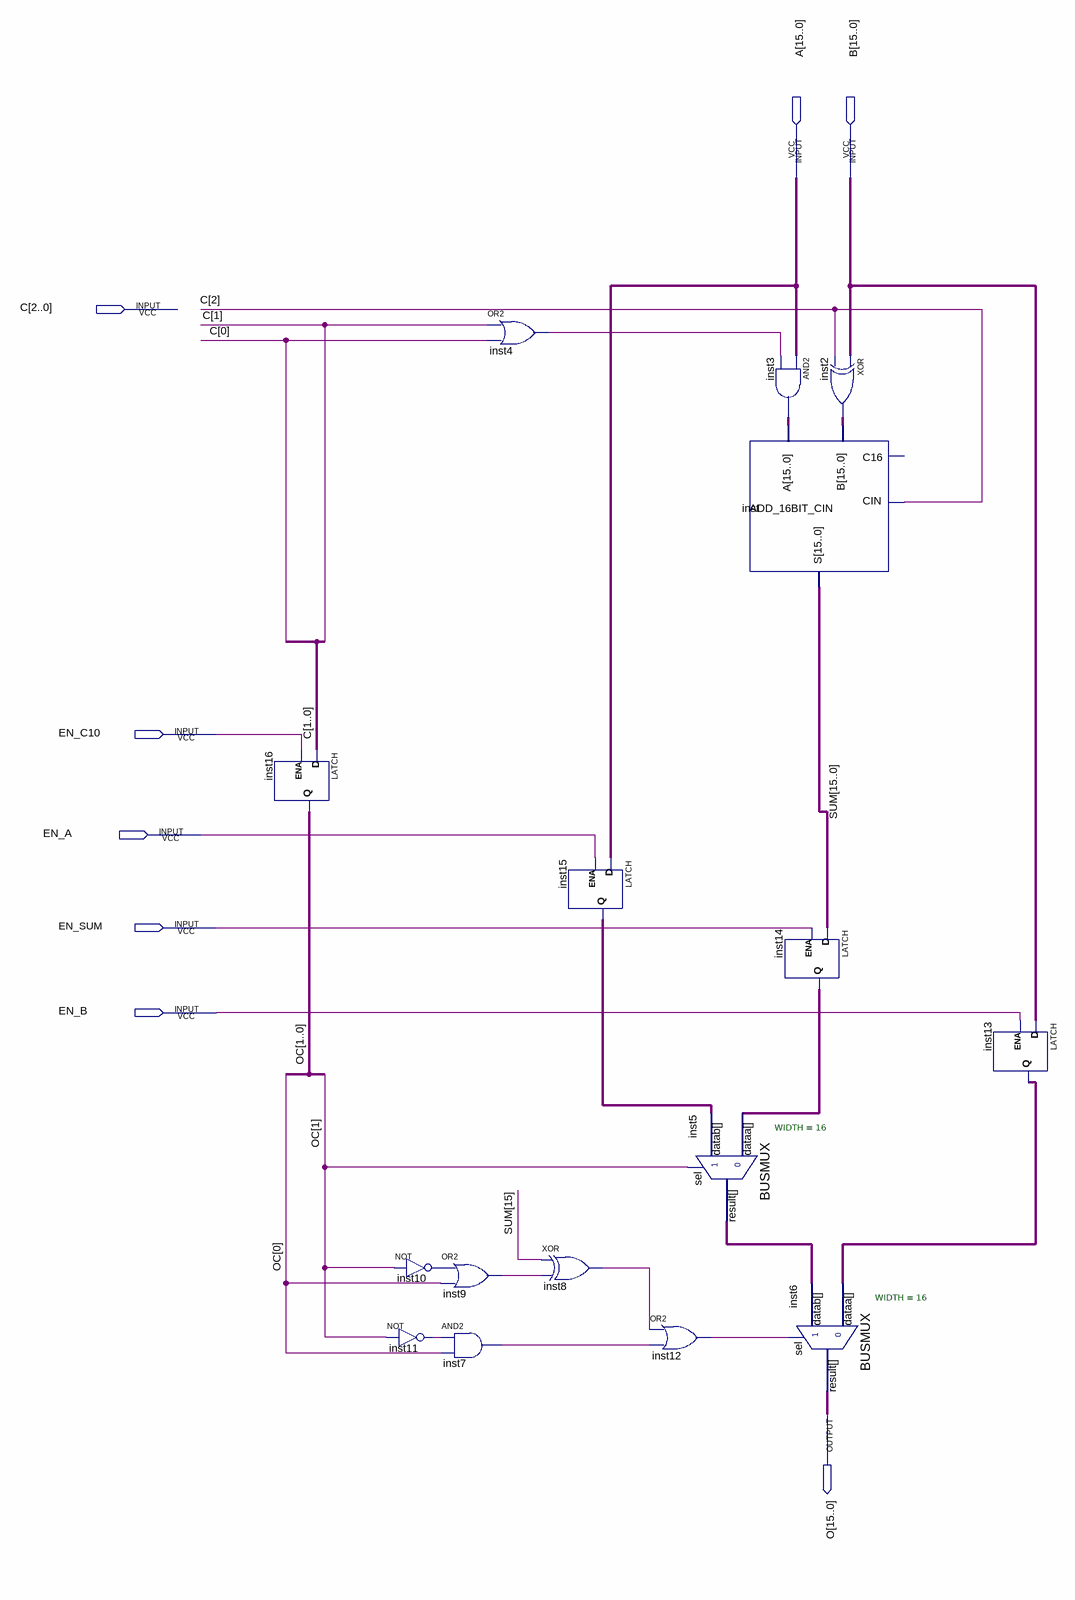
[diagram p0: schematic sheet]
// Quartus schematic AU_PIPELINEV1.bdf as structural Verilog: 16 symbols, 8 pins
module AU_PIPELINEV1 (
  input  [15:0] A,
  input  [15:0] B,
  input  [2:0] C,
  input  EN_C10,
  input  EN_A,
  input  EN_SUM,
  input  EN_B,
  output [15:0] O
);

  wire inst4_out, inst7_out, inst8_out, inst9_out, inst10_out, inst11_out, inst12_out;
  wire [1:0] OC;
  wire [15:0] inst2_out, inst3_out, inst5_result, inst13_q, inst14_q, inst15_q, SUM;

  LATCH inst16[1:0] (.D(C[1:0]), .ENA(EN_C10), .Q(OC));
  not inst10 (inst10_out, OC[1]);
  not inst11 (inst11_out, OC[1]);
  or inst9 (inst9_out, inst10_out, OC[0]);
  and inst7 (inst7_out, inst11_out, OC[0]);
  or inst4 (inst4_out, C[1], C[0]);
  xor inst8 (inst8_out, SUM[15], inst9_out);
  LATCH inst15[15:0] (.D(A), .ENA(EN_A), .Q(inst15_q));
  or inst12 (inst12_out, inst8_out, inst7_out);
  BUSMUX #(.WIDTH(16)) inst5 (.datab(inst15_q), .sel(OC[1]), .dataa(inst14_q), .result(inst5_result));
  assign inst3_out = A & {16{inst4_out}};  // AND2 inst3, 16 bits wide
  ADD_16BIT_CIN inst (.A(inst3_out), .B(inst2_out), .CIN(C[2]), .S(SUM));  // open: C16
  LATCH inst14[15:0] (.D(SUM), .ENA(EN_SUM), .Q(inst14_q));
  BUSMUX #(.WIDTH(16)) inst6 (.datab(inst5_result), .sel(inst12_out), .dataa(inst13_q), .result(O));
  assign inst2_out = B ^ {16{C[2]}};  // XOR inst2, 16 bits wide
  LATCH inst13[15:0] (.D(B), .ENA(EN_B), .Q(inst13_q));
endmodule
